# EAGLE design NanoShield (EAGLE 6.5.0)
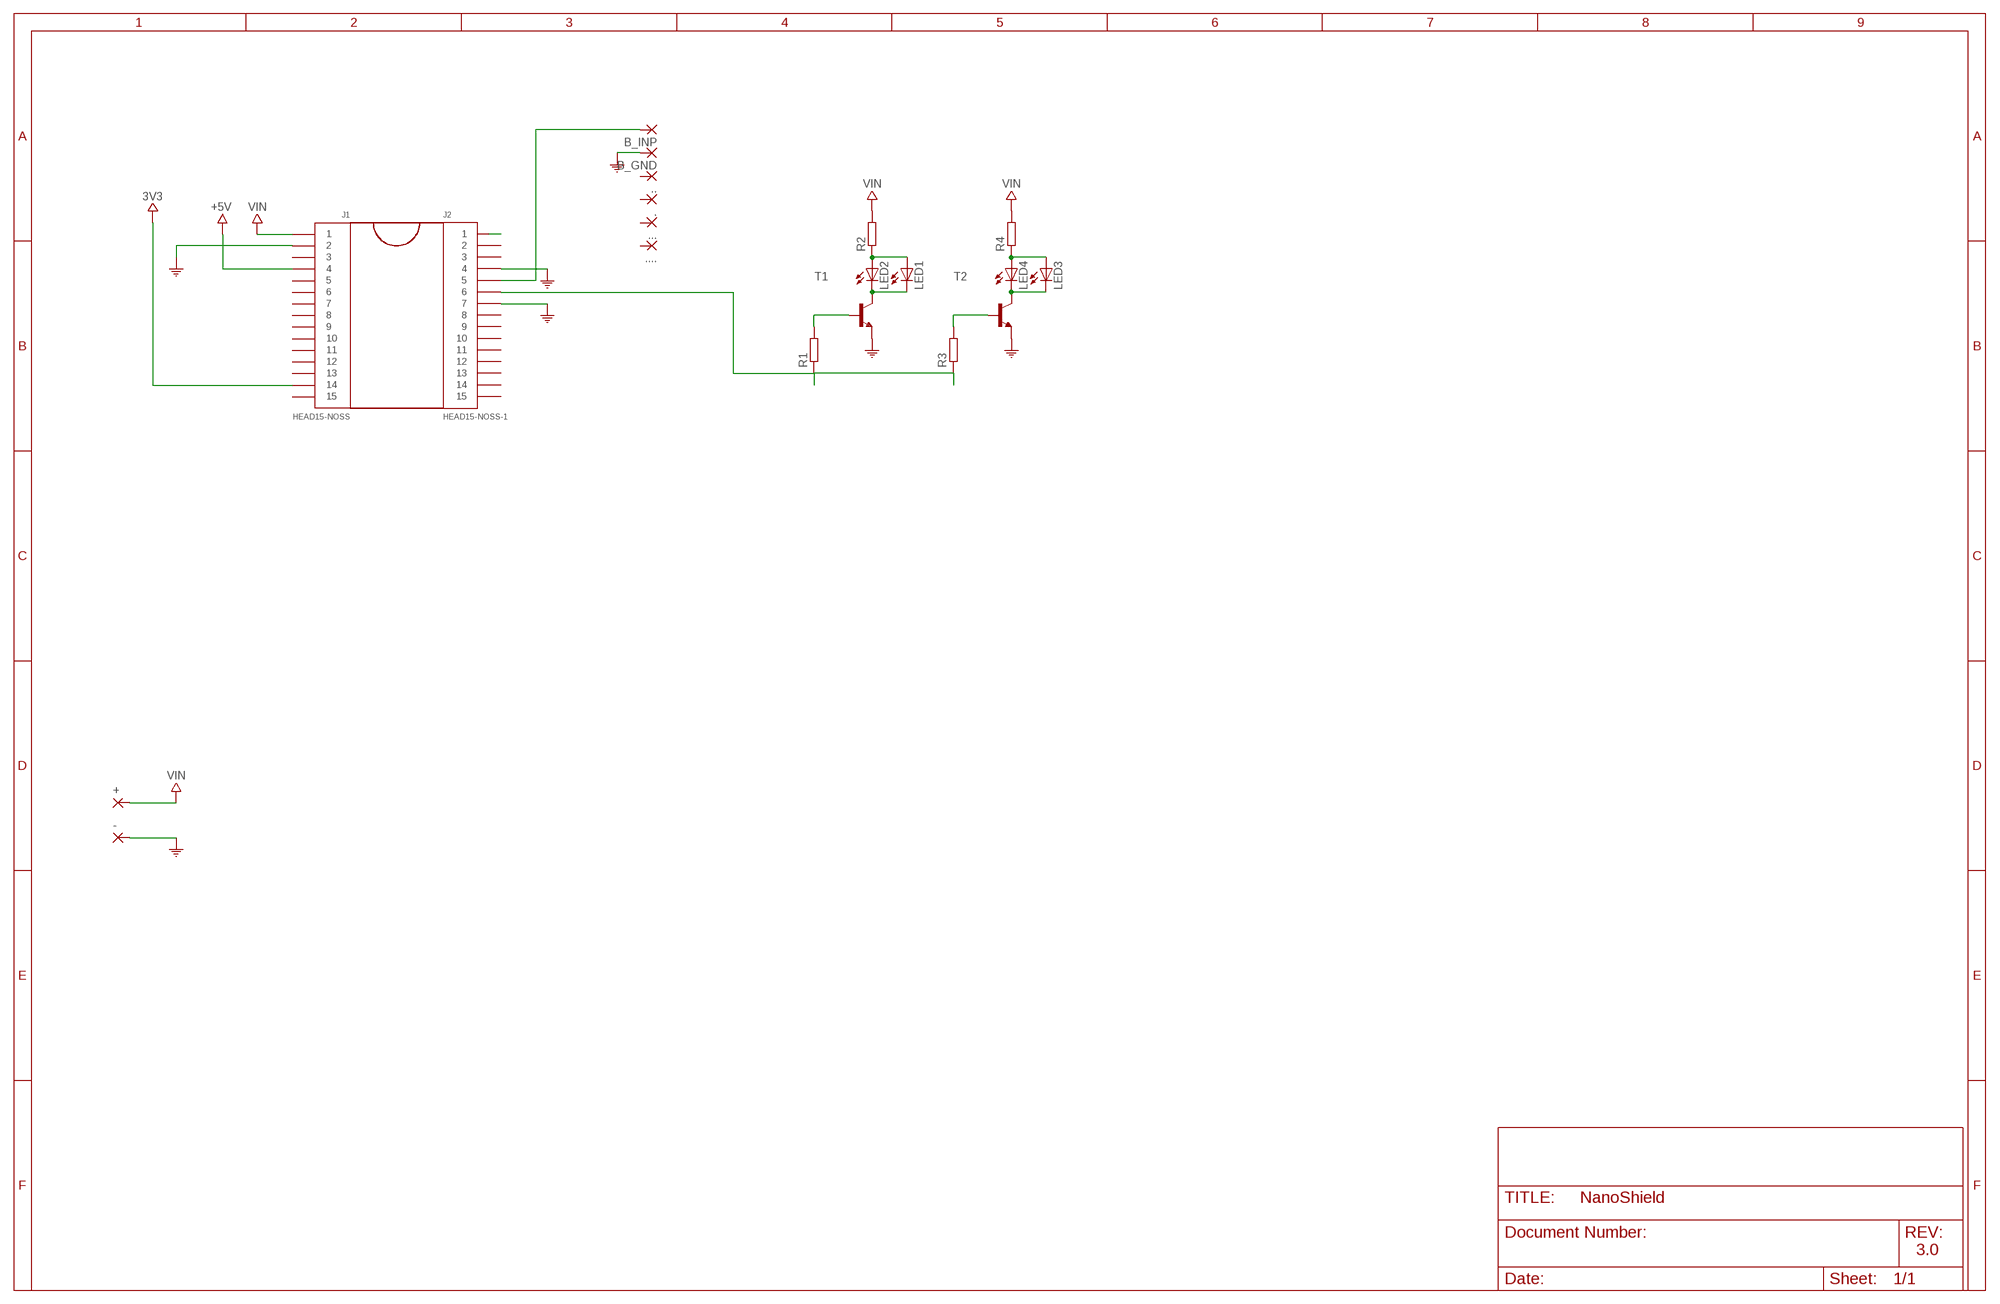
[diagram p0: schematic, sheet 1]

## Parts
+  1,6/0,8  [1,6/0,8]
-  1,6/0,8  [1,6/0,8]
.  1,6/0,8  [1,6/0,8]
..  1,6/0,8  [1,6/0,8]
...  1,6/0,8  [1,6/0,8]
....  1,6/0,8  [1,6/0,8]
B_GND  1,6/0,8  [1,6/0,8]
B_INP  1,6/0,8  [1,6/0,8]
J1  HEAD15-NOSS  [HEAD15-NOSS]
J2  HEAD15-NOSS-1  [HEAD15-NOSS-1]
LED1  LED5MM  [LED5MM]
LED2  LED5MM  [LED5MM]
LED3  LED5MM  [LED5MM]
LED4  LED5MM  [LED5MM]
R1  R-EU_0204/5  [0204/5]
R2  R-EU_0204/5  [0204/5]
R3  R-EU_0204/5  [0204/5]
R4  R-EU_0204/5  [0204/5]
T1  2N3904  [TO92]
T2  2N3904  [TO92]

## Nets
3V3: J1.14
+5V: J1.4
COM: -.1(P) B_GND.1(P) J1.2 J2.4 J2.7 T1.3(E) T2.3(E)
N$2: J2.1
N$3: LED1.K(C) LED2.K(C) T1.1(C)
N$4: LED3.K(C) LED4.K(C) T2.1(C)
N$5: R1.2 T1.2(B)
N$6: R3.2 T2.2(B)
N$7: LED1.A LED2.A R2.1
N$8: LED3.A LED4.A R4.1
N$9: J2.6 R1.1 R3.1
N$10: B_INP.1(P) J2.5
VIN: +.1(P) J1.1 R2.2 R4.2
Unconnected: ..1(P) ...1(P) ....1(P) .....1(P) J1.3 J1.5 J1.6 J1.7 J1.8 J1.9 J1.10 J1.11 J1.12 J1.13 J1.15 J2.2 J2.3 J2.8 J2.9 J2.10 J2.11 J2.12 J2.13 J2.14 J2.15

## Notes on the sheet
- 3.0

## Library data of the parts
+ - . .. ... .... B_GND B_INP = wirepad:1,6/0,8: THROUGH-HOLE PAD
J1 = MyCON2:HEAD15-NOSS
J2 = MyCON2:HEAD15-NOSS-1
LED1-LED4 = led:LED: LED OSRAM: - CHIPLED LG R971, LG N971, LY N971, LG Q971, LY Q971, LO R971, LY R971 LH N974, LH R974 LS Q976, LO Q976, LY Q976 LO Q996 - Hyper CHIPLED LW Q18S LB Q993, LB Q99A, LB R99A - SideLED LS A670, LO A670, LY A670, LG A670, LP A670 LB A673, LV A673, LT A673, LW A673 LH A674 LY A675 LS A676, LA A676, LO A676, LY A676, LW A676 LS A679, LY A679, LG A679 - Hyper Micro SIDELED® LS Y876, LA Y876, LO Y876, LY Y876 LT Y87S - SmartLED LW L88C, LW L88S LB L89C, LB L89S, LG L890 LS L89K, LO L89K, LY L89K LS L896, LA L896, LO L896, LY L896 - TOPLED LS T670, LO T670, LY T670, LG T670, LP T670 LSG T670, LSP T670, LSY T670, LOP T670, LYG T670 LG T671, LOG T671, LSG T671 LB T673, LV T673, LT T673, LW T673 LH T674 LS T676, LA T676, LO T676, LY T676, LB T676, LH T676, LSB T676, LW T676 LB T67C, LV T67C, LT T67C, LS T67K, LO T67K, LY T67K, LW E67C LS E67B, LA E67B, LO E67B, LY E67B, LB E67C, LV E67C, LT E67C LW T67C LS T679, LY T679, LG T679 LS T770, LO T770, LY T770, LG T770, LP T770 LB T773, LV T773, LT T773, LW T773 LH T774 LS E675, LA E675, LY E675, LS T675 LS T776, LA T776, LO T776, LY T776, LB T776 LHGB T686 LT T68C, LB T68C - Hyper Mini TOPLED® LB M676 - Mini TOPLED Santana® LG M470 LS M47K, LO M47K, LY M47K Source: http://www.osram.convergy.de LUXEON: - LUMILED® LXK2-PW12-R00, LXK2-PW12-S00, LXK2-PW14-U00, LXK2-PW14-V00 LXK2-PM12-R00, LXK2-PM12-S00, LXK2-PM14-U00 LXK2-PE12-Q00, LXK2-PE12-R00, LXK2-PE12-S00, LXK2-PE14-T00, LXK2-PE14-U00 LXK2-PB12-K00, LXK2-PB12-L00, LXK2-PB12-M00, LXK2-PB14-N00, LXK2-PB14-P00, LXK2-PB14-Q00 LXK2-PR12-L00, LXK2-PR12-M00, LXK2-PR14-Q00, LXK2-PR14-R00 LXK2-PD12-Q00, LXK2-PD12-R00, LXK2-PD12-S00 LXK2-PH12-R00, LXK2-PH12-S00 LXK2-PL12-P00, LXK2-PL12-Q00, LXK2-PL12-R00 Source: www.luxeon.com KINGBRIGHT: KA-3528ASYC Source: www.kingbright.com
R1-R4 = resistor:R-EU_: RESISTOR, European symbol
T1 T2 = transistor:2N3904: NPN TRANSISTOR

## Net classes
0 Default: width 0.203 mm, clearance 0.355 mm

## Board
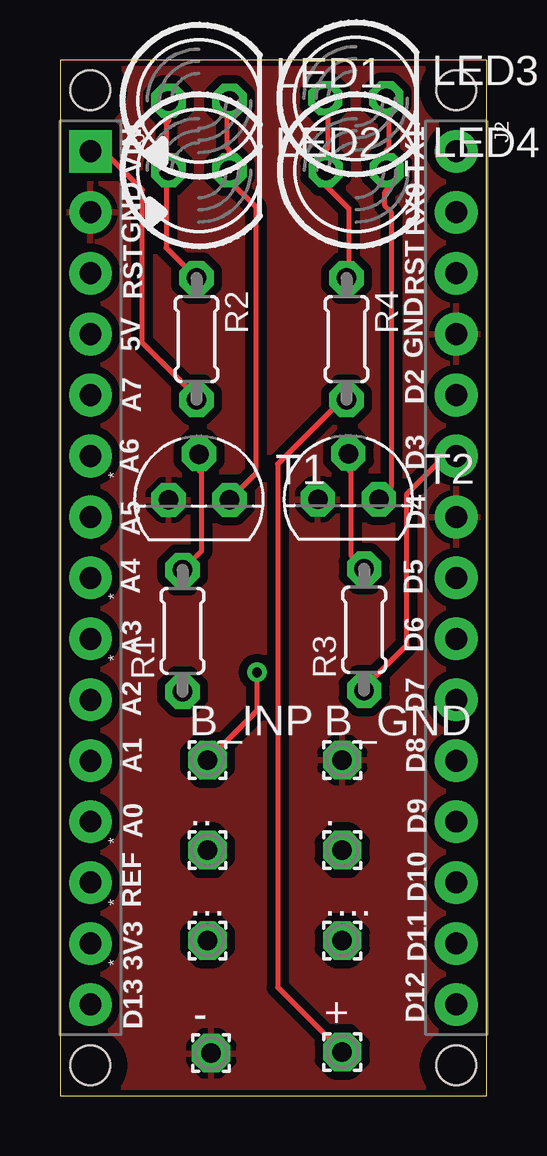
[diagram p1: board, top side]
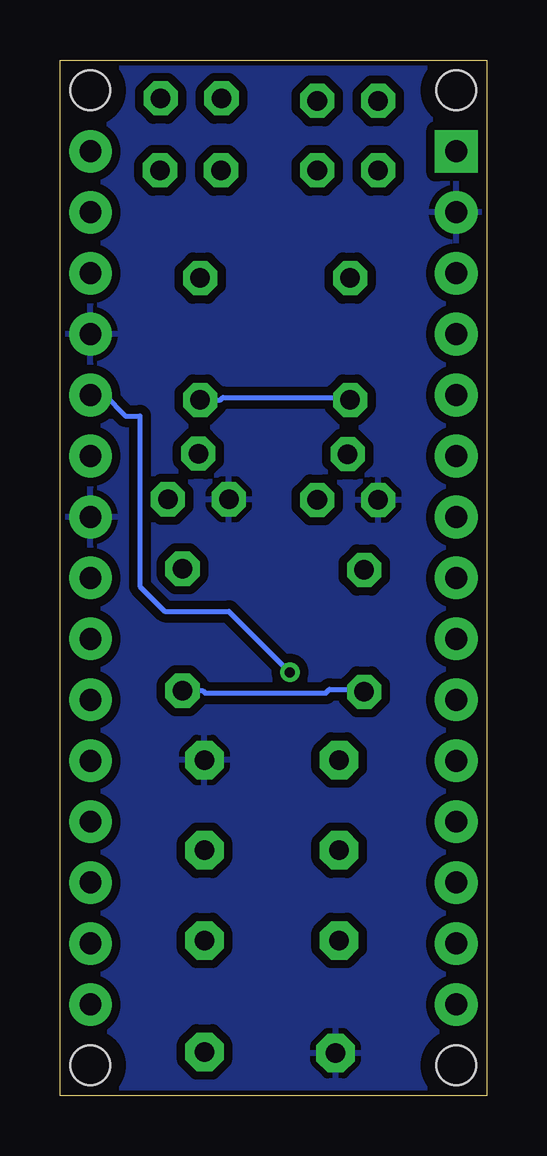
[diagram p2: board, bottom side, seen from below]

Size 17.78 x 43.18 mm. Coordinates in mm from the lower left corner, seen from the top.
Outline: 0,0 17.78,0 17.78,43.18 0,43.18 0,0
Copper layers (1*16): Top 0.035mm / dielectric 1.5mm / Bottom 0.035mm
Design rules "default *": minimum track width 8mil, minimum drill 16mil, track to track 8mil, track to pad 8mil, pad to pad 8mil, via to via 8mil, smd to smd 8mil, copper to edge 8mil, drill to drill 8mil, minimum pad ring 12mil, minimum via ring 8mil, stop-mask expansion 4mil, vias tented up to drill 18mil, thermal gap 10mil
Holes 1.65 mm at 1.27,1.27 16.51,1.27 16.51,41.91 1.27,41.91
tRestrict: area 0.1,0.1 to 2.4,2.4; area 15.4,40.8 to 17.7,43.1; area 15.4,0.1 to 17.7,2.4; area 0.1,40.8 to 2.4,43.1
bRestrict: area 15.4,0.1 to 17.7,2.4; area 0.1,0.1 to 2.4,2.4; area 0.1,40.8 to 2.4,43.1; area 15.4,40.8 to 17.7,43.1

### Footprints (pad centres in the part's own frame; a part is rotated, then mirrored left to right if it is on the bottom)
1,6/0,8 = drill 0.813 pad 1.6 octagon: 1 0,0
HEAD15-NOSS = drill 0.914 pad 1.778 square: 1 0,0 | drill 0.914 pad 1.778: 2 2.54,0; 3 5.08,0; 4 7.62,0; 5 10.16,0; 6 12.7,0; 7 15.24,0; 8 17.78,0; 9 20.32,0; 10 22.86,0; 11 25.4,0; 12 27.94,0; 13 30.48,0; 14 33.02,0; 15 35.56,0
HEAD15-NOSS-1 = drill 0.914 pad 1.778: 1 0,0; 2 2.54,0; 3 5.08,0; 4 7.62,0; 5 10.16,0; 6 12.7,0; 7 15.24,0; 8 17.78,0; 9 20.32,0; 10 22.86,0; 11 25.4,0; 12 27.94,0; 13 30.48,0; 14 33.02,0; 15 35.56,0
LED5MM = drill 0.813 octagon: A -1.27,0; K 1.27,0
0204/5 = drill 0.813 octagon: 1 -2.54,0; 2 2.54,0
TO92 = drill 0.813 octagon: 1 1.27,0; 2 0,1.905; 3 -1.27,0

### Placement (x,y rotation side)
+  11.76,1.83 0 top
-  6.3,1.78 0 top
.  11.76,10.24 0 top
..  6.15,10.24 0 top
...  6.15,6.48 0 top
....  11.76,6.48 0 top
B_GND  11.76,14 0 top
B_INP  6.15,14 0 top
J1  1.27,39.37 270 top
J2  16.51,39.37 270 top
LED1  5.79,41.48 0 top
LED2  5.79,38.58 0 top
LED3  12.32,41.58 0 top
LED4  12.34,38.58 0 top
R1  5.11,19.38 90 top
R2  5.69,31.55 270 top
R3  12.67,19.43 90 top
R4  11.94,31.55 270 top
T1  5.79,24.84 0 top
T2  12.01,24.87 0 top

### Tracks (layer width: path | path; a pad name or v marks a point on that pad's centre or on a via)
COM
  pour Top (isolate 0.254): 0.25,0.25 0.25,42.93 17.53,42.93 17.53,0.25
  pour Bottom (isolate 0.203): 0.25,0.25 0.25,42.93 17.53,42.93 17.53,0.25
N$3
  Top 0.203: T1.1 8.15,25.93 8.15,37.06 7.06,38.15 LED2.K 7.06,39.42 6.96,39.52 6.96,41.38 LED1.K
N$4
  Top 0.203: T2.1 13.79,25.38 13.79,36.85 13.51,37.13 13.51,37.64 13.61,37.74 LED4.K 13.61,39.42 13.72,39.52 13.72,41.45 LED3.K
N$5
  Top 0.203: R1.2 5.89,22.71 5.89,25.98 5.79,26.09 T1.2
N$6
  Top 0.203: R3.2 12.12,22.53 12.12,26.01 12.01,26.11 T2.2
N$7
  Top 0.203: LED1.A 4.52,40.64 4.42,40.54 4.42,38.68 LED2.A 4.42,38.56 4.42,35.36 R2.1
N$8
  Top 0.203: R4.1 12.04,34.19 12.04,36.98 11.07,37.95 LED4.A 11.07,39.42 11.18,39.52 11.18,41.45 LED3.A
N$9
  Top 0.203: J2.6 15.72,26.67 15.72,26.36 14.45,25.09 14.45,18.8 12.68,17.02 R3.1
  Bottom 0.203: R1.1 5.21,16.94 6.55,16.94 6.71,16.79 11.73,16.79 11.84,16.89 R3.1
N$10  (via drill 0.41)
  Top 0.203: B_INP.1 8.2,16.05 v8.2,17.65
  Bottom 0.203: v8.2,17.65 10.74,20.19 13.41,20.19 14.45,21.23 14.45,28.35 15.06,28.35 15.93,29.21 J2.5
VIN
  Top 0.203: +.1 9.07,4.52 9.07,26.34 11.73,29.01 R4.2 | J1.1 2.03,39.37 2.03,39.17 3.43,37.77 3.43,31.39 5.69,29.13 R2.2
  Bottom 0.203: 2.06,38.58 J1.1 | R2.2 5.79,29.11 11,29.11 11.1,29.01 R4.2

### Text on the board
tPlace: VIN | TX1 | GND | RX0 | RST | RST | 5V | GND | D2 | A7 | * | A6 | D3 | D4 | A5 | * | A4 | D5 | * | A3 | D6 | A2 | D7 | A1 | D8 | A0 | D9 | * | * | REF | D10 | D11 | * | 3V3 | D13 | D12